# Altium schematic sheet cSLIM_GPS.SchDoc
size 297 x 210 mm; SheetNumber: 10
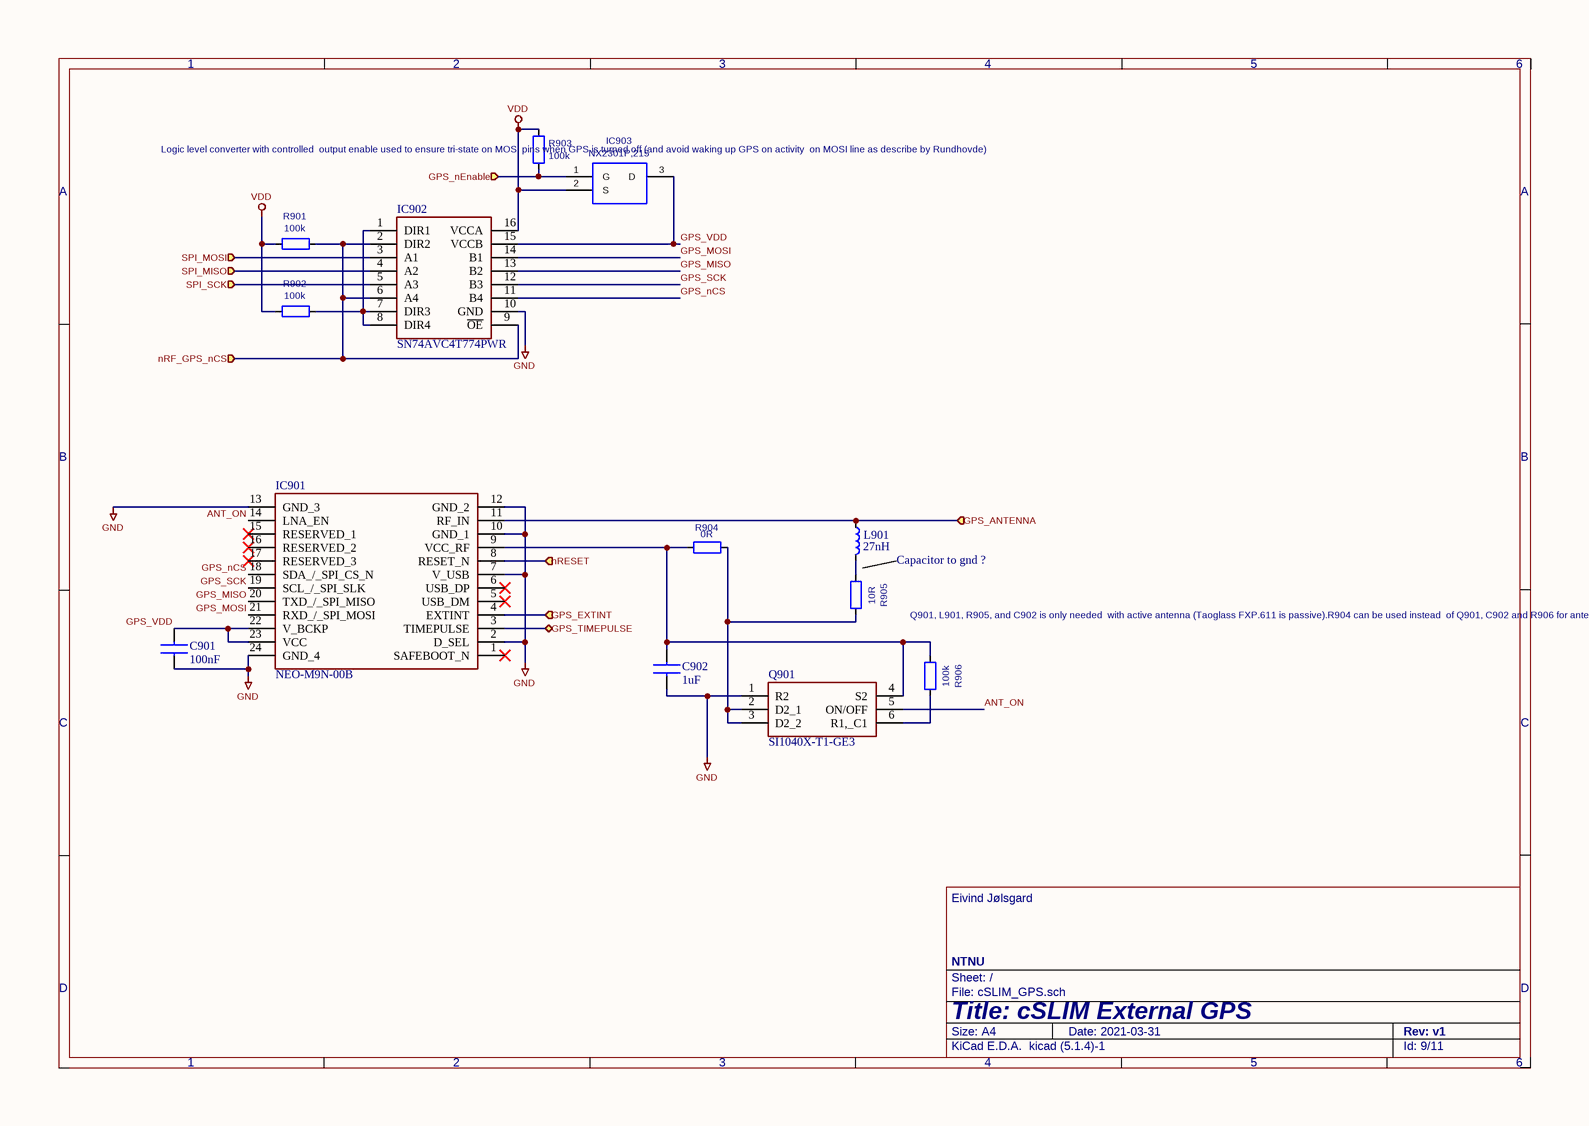
[diagram p0: cSLIM_GPS.SchDoc]

## Parts
C901  100nF  [CAPC1608X90N]
C902  1uF  [CAPC1608X90N]
IC901  NEO-M9N-00B  [NEOM9N00B]
IC902  SN74AVC4T774PWR  [SOP65P640X120-16N]
IC903  NX2301P,215  [SOT95P230X110-3N]
L901  27nH  [L-1608]
Q901  SI1040X-T1-GE3  [SOTFL50P160X60-6N]
R901  100k  [RESC1608X55N]
R902  100k  [RESC1608X55N]
R903  100k  [RESC1608X55N]
R904  0R  [RESC1608X55N]
R905  10R  [RESC1608X55N]
R906  100k  [RESC1608X55N]

## Ports
GPS_ANTENNA (in), GPS_EXTINT (in), GPS_nEnable (in), GPS_TIMEPULSE (bidir), nRESET (in), nRF_GPS_nCS (in), SPI_MISO (in), SPI_MOSI (in), SPI_SCK (in)

## Nets
GND: C901.2 C902.2 IC901.2(D_SEL) IC901.7(V_USB) IC901.10(GND_1) IC901.12(GND_2) IC901.13(GND_3) IC901.24(GND_4) IC902.10(GND) Q901.1(R2)
VDD: IC902.16(VCCA) IC903.2(S) R901.2 R902.2 R903.2
ANT_ON: IC901.14(LNA_EN) Q901.5(ON/OFF)
GPS_ANTENNA: IC901.11(RF_IN) L901.1 ; port GPS_ANTENNA
GPS_EXTINT: IC901.4(EXTINT) ; port GPS_EXTINT
GPS_MISO: IC901.20(TXD_/_SPI_MISO) IC902.13(B2)
GPS_MOSI: IC901.21(RXD_/_SPI_MOSI) IC902.14(B1)
GPS_nCS: IC901.18(SDA_/_SPI_CS_N) IC902.11(B4)
GPS_nEnable: IC903.1(G) R903.1 ; port GPS_nEnable
GPS_SCK: IC901.19(SCL_/_SPI_SLK) IC902.12(B3)
GPS_TIMEPULSE: IC901.3(TIMEPULSE) ; port GPS_TIMEPULSE
GPS_VDD: C901.1 IC901.22(V_BCKP) IC901.23(VCC) IC902.15(VCCB) IC903.3(D)
nRESET: IC901.8(RESET_N) ; port nRESET
nRF_GPS_nCS: IC902.2(DIR2) IC902.6(A4) IC902.9(~{OE}) R901.1 ; port nRF_GPS_nCS
SPI_MISO: IC902.4(A2) ; port SPI_MISO
SPI_MOSI: IC902.3(A1) ; port SPI_MOSI
SPI_SCK: IC902.5(A3) ; port SPI_SCK
NetC902_1: C902.1 IC901.9(VCC_RF) Q901.4(S2) R904.2 R906.2
NetIC902_1: IC902.1(DIR1) IC902.7(DIR3) IC902.8(DIR4) R902.1
NetL901_2: L901.2 R905.2
NetQ901_2: Q901.2(D2_1) Q901.3(D2_2) R904.1 R905.1
NetQ901_6: Q901.6(R1,_C1) R906.1

Not connected (* = marked no-connect by the designer): IC901 1(SAFEBOOT_N)* 5(USB_DM)* 6(USB_DP)* 15(RESERVED_1)* 16(RESERVED_2)* 17(RESERVED_3)*

## Notes on the sheet
- (near R903) Logic level converter with controlled
  output enable used to ensure tri-state
  on MOSI pins when GPS is turned off
  (and avoid waking up GPS on activity
  on MOSI line as describe by Rundhovde)
- Capacitor to gnd ?
- Q901, L901, R905, and C902 is only needed
  with active antenna (Taoglass FXP.611 is passive).R904 can be used instead
  of Q901, C902 and R906 for antenna always on.
- 1
- 2
- 3
- 4
- 5
- 6
- A
- B
- C
- Eivind Jølsgard
- D
- Title: cSLIM External GPS
- File: cSLIM_GPS.sch
- Sheet: /
- NTNU
- KiCad E.D.A.  kicad (5.1.4)-1
- Size: A4
- Date: 2021-03-31
- Rev: v1
- Id: 9/11

## Library data of the parts
C901 C902 = C: Capacitor; Manufacturer_Name: AVX; Manufacturer_Part_Number: 06033G104ZAT2A; Datasheet Link: http://www.mouser.com/catalog/supplier/library/pdf/AVXSurfaceMountCeramic.pdf; Height: 0.9mm; Mouser Part Number: 581-06033G104Z; Mouser Price/Stock: https://www.mouser.co.uk/ProductDetail/AVX/06033G104ZAT2A?qs=NXubJDmysXJMPmHfVo6Z%252BA%3D%3D; Arrow Part Number: 06033G104ZAT2A; Arrow Price/Stock: https://www.arrow.com/en/products/06033g104zat2a/avx?region=nac
IC901 = NEO-M9N-00B: Integrated Circuit; Manufacturer_Name: U-Blox; Datasheet Link: https://www.u-blox.com/sites/default/files/NEO-M9N_DataSheet_%28UBX-19014285%29.pdf; Height: 2.6mm; Manufacturer_Part_Number: NEO-M9N-00B; Mouser Part Number: 377-NEO-M9N-00B; Mouser Price/Stock: https://www.mouser.co.uk/ProductDetail/u-blox/NEO-M9N-00B?qs=DPoM0jnrROVeJ6BHpcwcjw%3D%3D
IC902 = SN74AVC4T774PWR: Integrated Circuit; Manufacturer_Name: Texas Instruments; Datasheet Link: http://www.ti.com/lit/gpn/sn74avc4t774; Height: 1.2mm; Manufacturer_Part_Number: SN74AVC4T774PWR; Mouser Part Number: 595-SN74AVC4T774PWR; Mouser Price/Stock: https://www.mouser.co.uk/ProductDetail/Texas-Instruments/SN74AVC4T774PWR?qs=WxL8HmPi5r562Eu%2F2kE2LA%3D%3D; Arrow Part Number: SN74AVC4T774PWR; Arrow Price/Stock: https://www.arrow.com/en/products/sn74avc4t774pwr/texas-instruments?region=nac
IC903 = NX2301P,215: Manufacturer_Name: Nexperia; Height: 1.1; Mouser Part Number: 771-NX2301P215; Mouser Price/Stock: https://www.mouser.co.uk/ProductDetail/Nexperia/NX2301P215?qs=A1cBxND5mHKs%252BLrxCDENxw%3D%3D; Manufacturer_Part_Number: NX2301P,215; Value: NX2301P,215; Footprint: SamacSys:SOT95P230X110-3N
L901 = L
Q901 = SI1040X-T1-GE3: MOSFET (N-Channel); Manufacturer_Name: Vishay; Datasheet Link: https://www.vishay.com/docs/71809/si1040x.pdf; Height: 0.6mm; Manufacturer_Part_Number: SI1040X-T1-GE3; Mouser Part Number: 781-SI1040X-T1-GE3; Mouser Price/Stock: https://www.mouser.co.uk/ProductDetail/Vishay-Semiconductors/SI1040X-T1-GE3?qs=tWM4QuTcS4WRJw%2FdSgdX6Q%3D%3D; Arrow Part Number: SI1040X-T1-GE3; Arrow Price/Stock: https://www.arrow.com/en/products/si1040x-t1-ge3/vishay
R901-R906 = R
  R901-R903 R906: Value: 100k
  R904: Value: 0R
  R905: Value: 10R